# Altium schematic sheet Glasses-LEDBoard.SchDoc
size A4
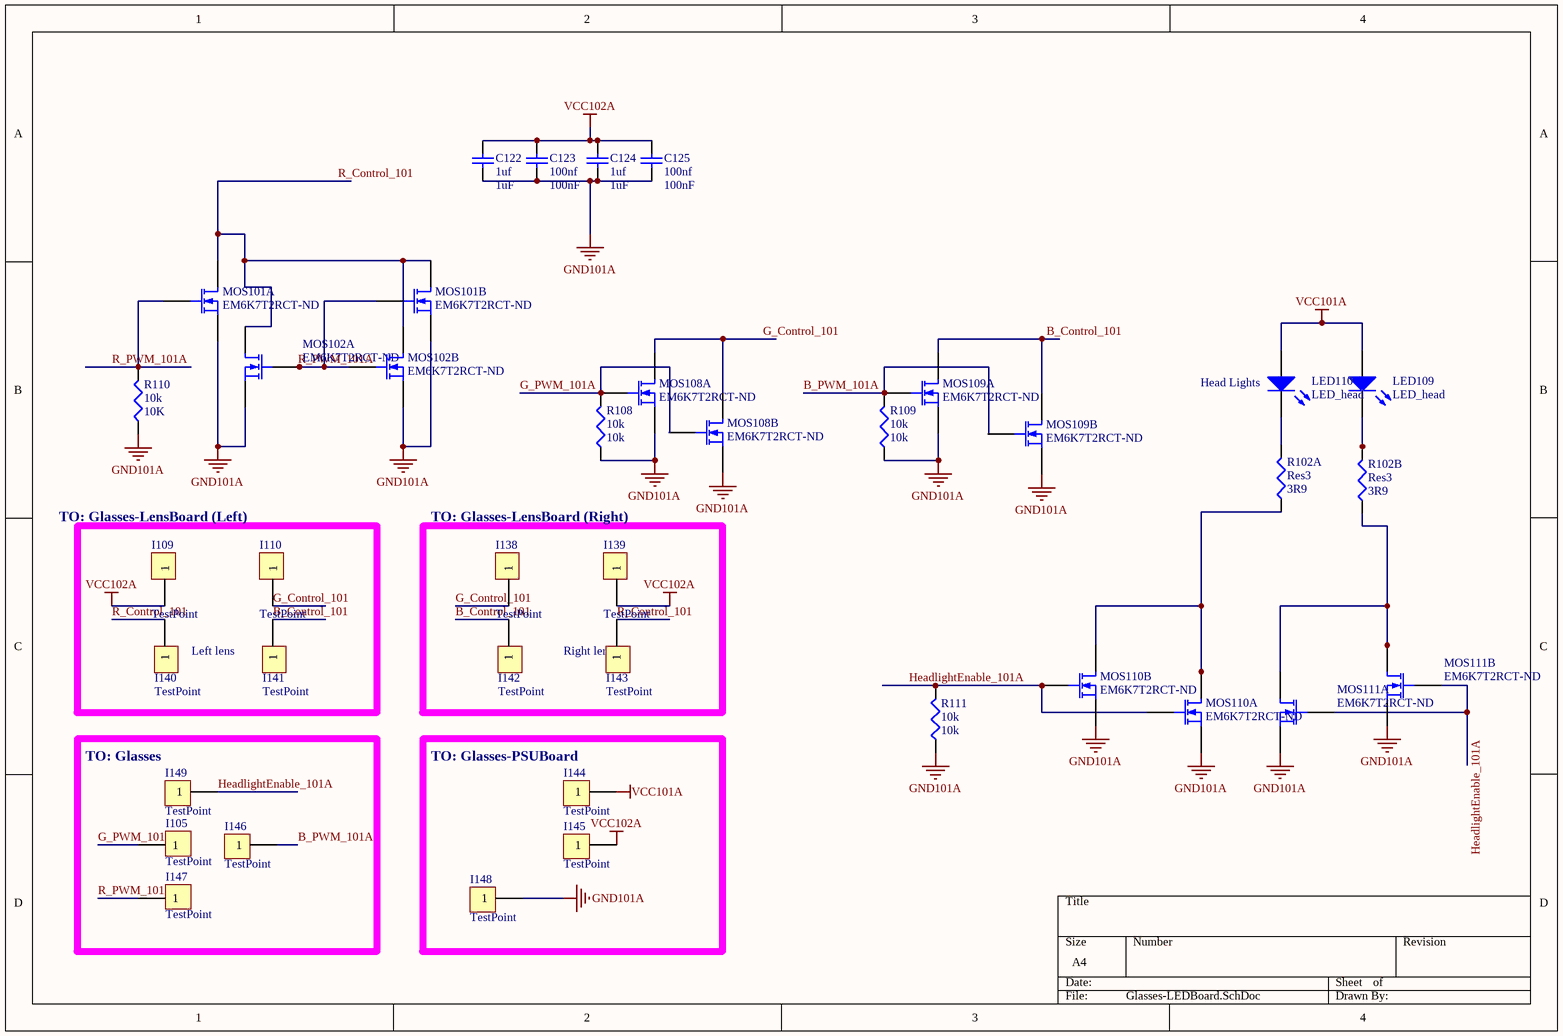
[diagram p0: Glasses-LEDBoard.SchDoc]

## Parts
C122  1uf  [0603]
C123  100nf  [0603]
C124  1uf  [0603]
C125  100nf  [0603]
I105  TestPoint  [TestPoint]
I109  TestPoint  [TestPoint]
I110  TestPoint  [TestPoint]
I138  TestPoint  [TestPoint]
I139  TestPoint  [TestPoint]
I140  TestPoint  [TestPoint]
I141  TestPoint  [TestPoint]
I142  TestPoint  [TestPoint]
I143  TestPoint  [TestPoint]
I144  TestPoint  [TestPoint]
I145  TestPoint  [TestPoint]
I146  TestPoint  [TestPoint]
I147  TestPoint  [TestPoint]
I148  TestPoint  [TestPoint]
I149  TestPoint  [TestPoint]
LED109  LED_head  [LED Headlamp]
LED110  LED_head  [LED Headlamp]
MOS101  EM6K7T2RCT-ND  [EM6K7T2R-EMT6]  (parts A,B of 2)
MOS102  EM6K7T2RCT-ND  [EM6K7T2R-EMT6]  (parts A,B of 2)
MOS108  EM6K7T2RCT-ND  [EM6K7T2R-EMT6]  (parts A,B of 2)
MOS109  EM6K7T2RCT-ND  [EM6K7T2R-EMT6]  (parts A,B of 2)
MOS110  EM6K7T2RCT-ND  [EM6K7T2R-EMT6]  (parts A,B of 2)
MOS111  EM6K7T2RCT-ND  [EM6K7T2R-EMT6]  (parts A,B of 2)
R102A  Res3  value 3R9  [0805]
R102B  Res3  value 3R9  [0805]
R108  10k  [0603]
R109  10k  [0603]
R110  10k  [0603]
R111  10k  [0603]

## Blocks framed on the sheet
Left lens: I109 I110 I140 I141
TO: Glasses-LensBoard (Right): I138 I139 I142 I143
TO: Glasses: I105 I146 I147 I149
TO: Glasses-PSUBoard: I144 I145 I148

## Nets
GND101A: C122.1 C123.1 C124.1 C125.1 I148.1 MOS101.1(S) MOS101.4(S) MOS102.1(S) MOS102.4(S) MOS108.1(S) MOS108.4(S) MOS109.1(S) MOS109.4(S) MOS110.1(S) MOS110.4(S) MOS111.1(S) MOS111.4(S) R108.1 R109.1 R110.1 R111.1
VCC101A: I144.1 LED109.1(A) LED110.1(A)
VCC102A: C122.2 C123.2 C124.2 C125.2 I109.1 I139.1 I145.1
B_Control_101: I141.1 I142.1 MOS109.3(D) MOS109.6(D)
B_PWM_101A: I146.1 MOS109.2(G) MOS109.5(G) R109.2
G_Control_101: I110.1 I138.1 MOS108.3(D) MOS108.6(D)
G_PWM_101A: I105.1 MOS108.2(G) MOS108.5(G) R108.2
HeadlightEnable_101A: I149.1 MOS110.2(G) MOS110.5(G) MOS111.2(G) MOS111.5(G) R111.2
R_Control_101: I140.1 I143.1 MOS101.3(D) MOS101.6(D) MOS102.3(D) MOS102.6(D)
R_PWM_101A: I147.1 MOS101.2(G) MOS101.5(G) MOS102.2(G) MOS102.5(G) R110.2
NetLED109_2: LED109.2(K) R102B.2
NetLED110_2: LED110.2(K) R102A.2
NetMOS110_3: MOS110.3(D) MOS110.6(D) R102A.1
NetMOS111_3: MOS111.3(D) MOS111.6(D) R102B.1

## Notes on the sheet
- (near LED110) Head Lights
- TO: Glasses-LensBoard (Left)
- (near I143) Right lens

## Library data of the parts
C122-C125 = Cap Semi: Capacitor (Semiconductor SIM Model); Published: 8-Jun-2000; LatestRevisionDate: 29-May-2009; LatestRevisionNote: IPC-7351 Footprint Added.; PackageReference: C1206; Publisher: Altium Limited; PackageDescription: Chip Capacitor
  C122 C124: Value: 1uF
  C123 C125: Value: 100nF
LED109 LED110 = LED0: Typical INFRARED GaAs LED; Published: 8-Jun-2000; LatestRevisionDate: 08-Jul-2005; LatestRevisionNote: Mech Layer 1 removed.; PackageReference: LED-0; Publisher: Altium Limited
R102A R102B R108-R111 = Res3: Resistor; Published: 8-Jun-2000; LatestRevisionDate: 29-May-2009; LatestRevisionNote: IPC-7351 Footprint Added.; PackageReference: J1-0603; Publisher: Altium Limited; PackageDescription: Chip Resistor
  R108 R109 R111: Value: 10k
  R110: Value: 10K
MOS101 MOS102 MOS108-MOS111 = EM6K7T2RCT-ND: Supplier 1: Digi-Key